# EAGLE design untitled (EAGLE 9.0.1)
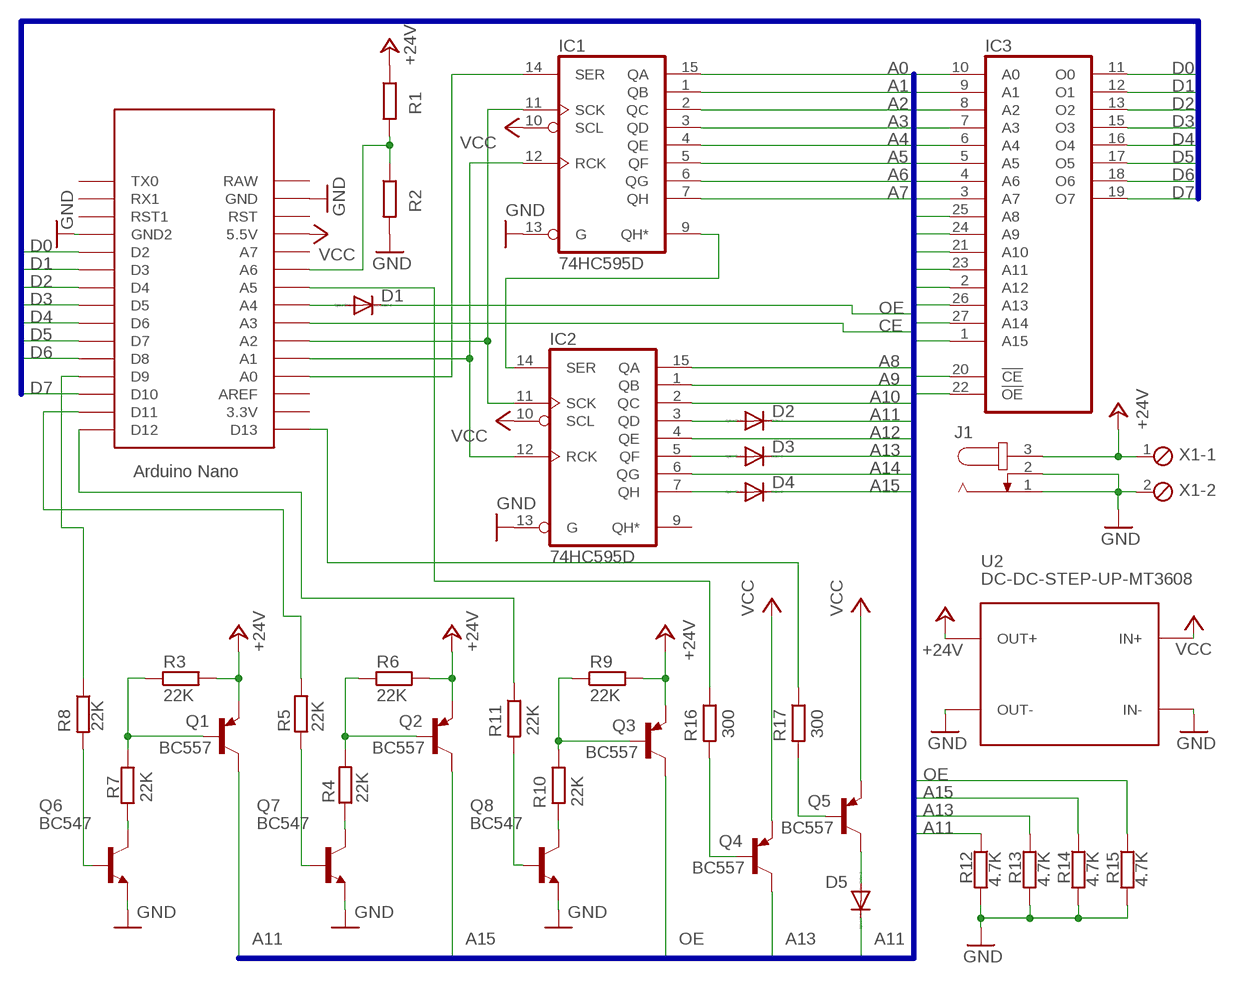
[diagram p0: schematic, sheet 1]

## Parts
D1  1N4446  [DO35-10]
D2  1N4446  [DO35-10]
D3  1N4446  [DO35-10]
D4  1N4446  [DO35-10]
D5  1N4446  [DO35-10]
IC1  74HC595D  [SO16]
IC2  74HC595D  [SO16]
IC3  27512  [DIL28]
J1  JACK-PLUG1  [SPC4078]
Q1  BC557  [TO92]
Q2  BC557  [TO92]
Q3  BC557  [TO92]
Q4  BC557  [TO92]
Q5  BC557  [TO92]
Q6  BC547  [TO92]
Q7  BC547  [TO92]
Q8  BC547  [TO92]
R1  R-EU_M0805  [M0805]
R2  R-EU_M0805  [M0805]
R3  22K  R-EU_M0805  [M0805]
R4  22K  R-EU_M0805  [M0805]
R5  22K  R-EU_M0805  [M0805]
R6  22K  R-EU_M0805  [M0805]
R7  22K  R-EU_M0805  [M0805]
R8  22K  R-EU_M0805  [M0805]
R9  22K  R-EU_M0805  [M0805]
R10  22K  R-EU_M0805  [M0805]
R11  22K  R-EU_M0805  [M0805]
R12  4.7K  R-EU_M0805  [M0805]
R13  4.7K  R-EU_M0805  [M0805]
R14  4.7K  R-EU_M0805  [M0805]
R15  4.7K  R-EU_M0805  [M0805]
R16  300  R-EU_M0805  [M0805]
R17  300  R-EU_M0805  [M0805]
U1  NANO  [NANO]
U2  DC-DC-STEP-UP-MT3608  [DC-DC-STEP-UP-MT3608]
X1  MPT2  [2POL254]

## Nets
+24V: J1.3 Q1.1(E) Q2.1(E) Q3.1(E) R1.1 R3.2 R6.2 R9.2 U2.OUT+ X1.1
A0: IC1.15(QA) IC3.10(A0)
A1: IC1.1(QB) IC3.9(A1)
A2: IC1.2(QC) IC3.8(A2)
A3: IC1.3(QD) IC3.7(A3)
A4: IC1.4(QE) IC3.6(A4)
A5: IC1.5(QF) IC3.5(A5)
A6: IC1.6(QG) IC3.4(A6)
A7: IC1.7(QH) IC3.3(A7)
A8: IC2.15(QA) IC3.25(A8)
A9: IC2.1(QB) IC3.24(A9)
A10: IC2.2(QC) IC3.21(A10)
A11: D2.C D5.C IC3.23(A11) Q1.3(C) R12.1
A12: IC2.4(QE) IC3.2(A12)
A13: D3.C IC3.26(A13) Q4.3(C) R13.1
A14: IC2.6(QG) IC3.27(A14)
A15: D4.C IC3.1(A15) Q2.3(C) R14.1
CE: IC3.20(!CE) U1.A3
D0: IC3.11(O0) U1.D2
D1: IC3.12(O1) U1.D3
D2: IC3.13(O2) U1.D4
D3: IC3.15(O3) U1.D5
D4: IC3.16(O4) U1.D6
D5: IC3.17(O5) U1.D7
D6: IC3.18(O6) U1.D8
D7: IC3.19(O7) U1.D10
GND: IC1.13(G) IC2.13(G) J1.1 J1.2 Q6.1(E) Q7.1(E) Q8.1(E) R2.2 R12.2 R13.2 R14.2 R15.2 U1.GND U1.GND1(GND2) U2.IN- U2.OUT- X1.2
N$1: IC1.11(SCK) IC2.11(SCK) U1.A2
N$2: IC1.12(RCK) IC2.12(RCK) U1.A1
N$3: IC1.9(QH*) IC2.14(SER)
N$4: IC1.14(SER) U1.A0
N$5: D2.A IC2.3(QD)
N$6: D3.A IC2.5(QF)
N$7: R8.1 U1.D9
N$8: D1.A U1.A4
N$9: R1.2 R2.1 U1.A6
N$10: R16.1 U1.A5
N$11: R5.2 U1.D11
N$12: R17.1 U1.D13
N$13: R11.1 U1.D12
N$14: D4.A IC2.7(QH)
N$15: D5.A Q5.3(C)
N$16: Q8.3(C) R10.2
N$17: Q3.2(B) R9.1 R10.1
N$18: Q8.2(B) R11.2
N$19: Q7.3(C) R4.1
N$20: Q2.2(B) R4.2 R6.1
N$21: Q7.2(B) R5.1
N$22: Q6.3(C) R7.2
N$23: Q1.2(B) R3.1 R7.1
N$24: Q6.2(B) R8.2
N$25: Q4.2(B) R16.2
N$26: Q5.2(B) R17.2
OE: D1.C IC3.22(!OE) Q3.3(C) R15.1
VCC: IC1.10(SCL) IC2.10(SCL) Q4.1(E) Q5.1(E) U1.5V(5.5V) U2.IN+
Unconnected: IC2.9(QH*) U1.3.3V U1.A7 U1.AREF U1.ICSP1 U1.ICSP2 U1.ICSP3 U1.ICSP4 U1.ICSP5 U1.ICSP6 U1.RAW U1.RST U1.RST1 U1.RX1 U1.TX0

## Buses
A0,A1,A2,A3,A4,A5,A6,A7,A8,A9,A10,A11,A12,A13,A14,A15,CE,OE
D0,D1,D2,D3,D4,D5,D6,D7

## Power pins joined to a net without a drawn wire
GND: IC1.8(GND) IC2.8(GND) IC3.14(GND)
VCC: IC1.16(VCC) IC2.16(VCC) IC3.28(VCC)

## Library data of the parts
D1-D5 = diode:1N4446: DIODE high speed (Philips)
IC1 IC2 = 74xx-eu:74*595: 8-bit SHIFT REGISTER, output latch
IC3 = memory:27512: MEMORY
J1 = con-jack:JACK-PLUG: DC POWER JACK Power Jack, DC, Right Angle, Through Hole, Rated 5A at 16VDC, PC Terminals Distributor: Farnell (www.Farnell.de) Drawing: 84N1161.pdf / 84N1162.pdf Manufacturer: SPC Technology (www.spctechnology.com) Type: SPC4077 / SPC 4078; OC_FARNELL: unknown; OC_NEWARK: unknown
Q1-Q5 = transistor-pnp:BC557: PNP Transistor
Q6-Q8 = transistor-npn:BC547*: NPN Transistor
R1-R17 = rcl:R-EU_: RESISTOR, European symbol; SPICEPREFIX: R
U1 = Arduino-clone:NANO: Arduino Nano
U2 = diy-modules:DC-DC-STEP-UP-MT3608: DC/DC Step-Up Regulator based on MT3608 chip MT3608 datasheet available here: https://www.olimex.com/Products/Breadboarding/BB-PWR-3608/resources/MT3608.pdf Click here to find device on ebay.com <http://www.ebay.com/sch/mt3608+module>
X1 = con-phoenix-254:MPT2: PHOENIX CONNECTOR; OC_FARNELL: unknown; OC_NEWARK: unknown

## Board
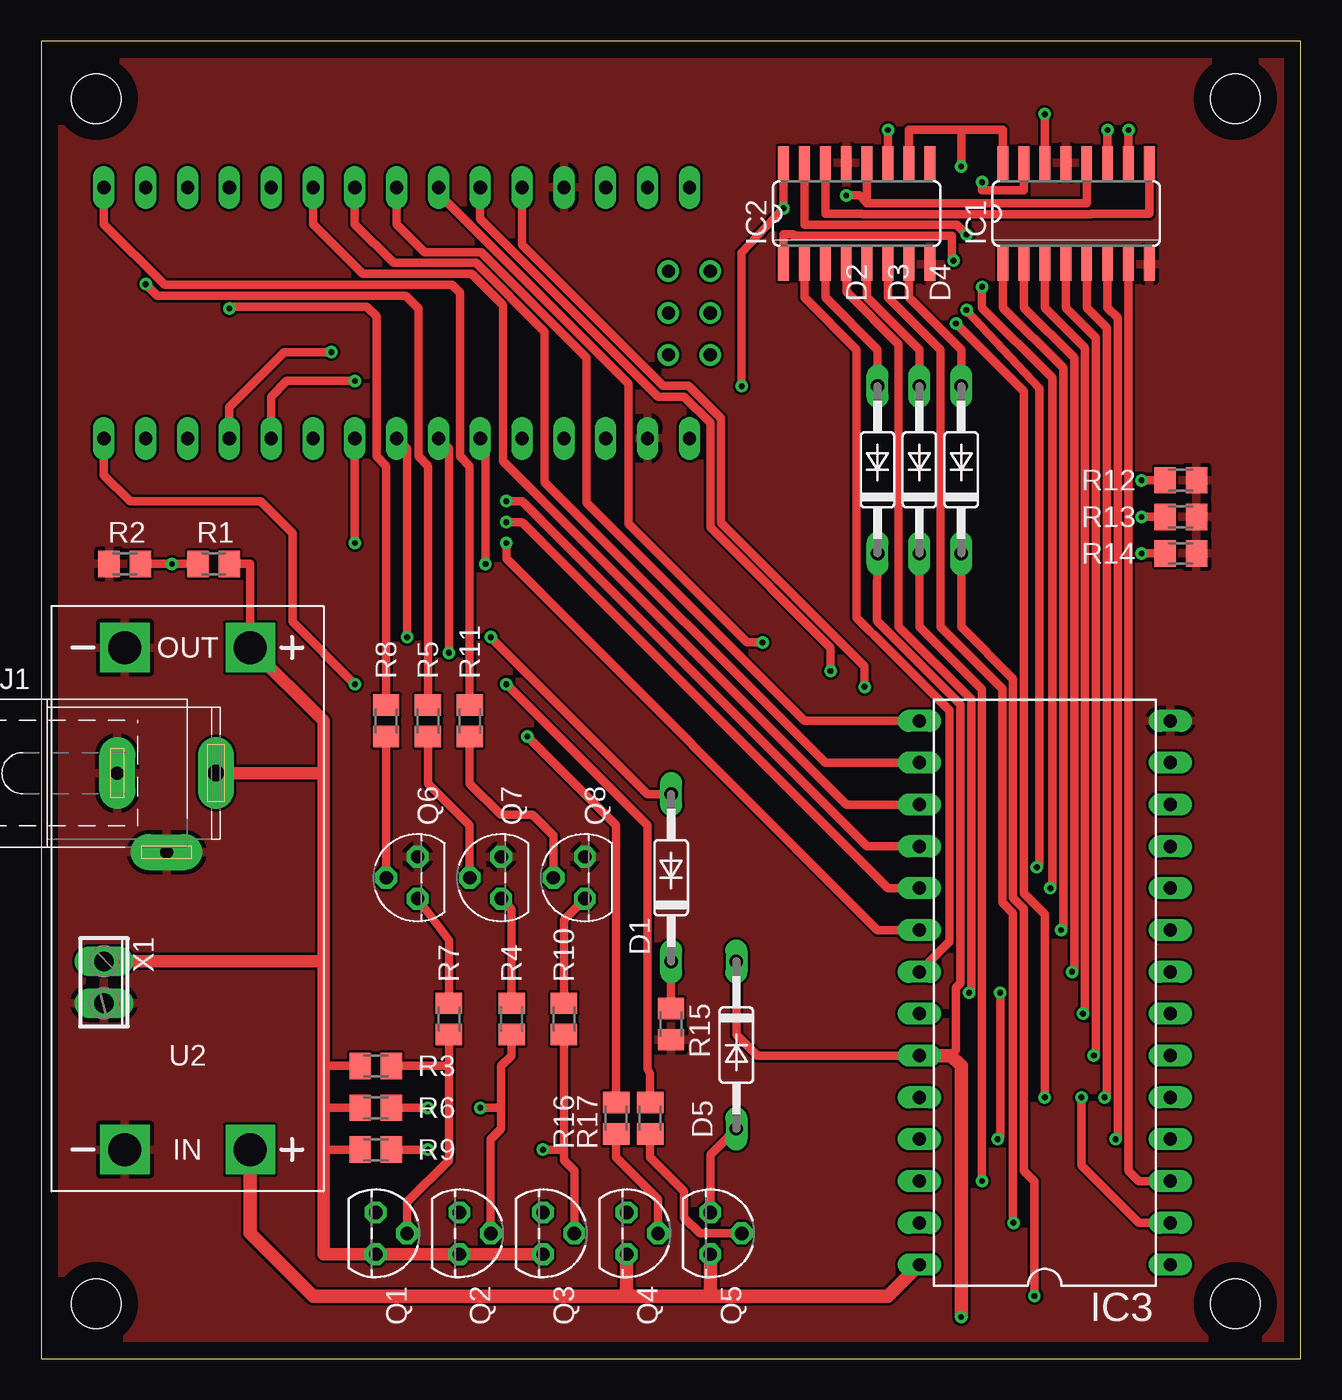
[diagram p1: board, top side]
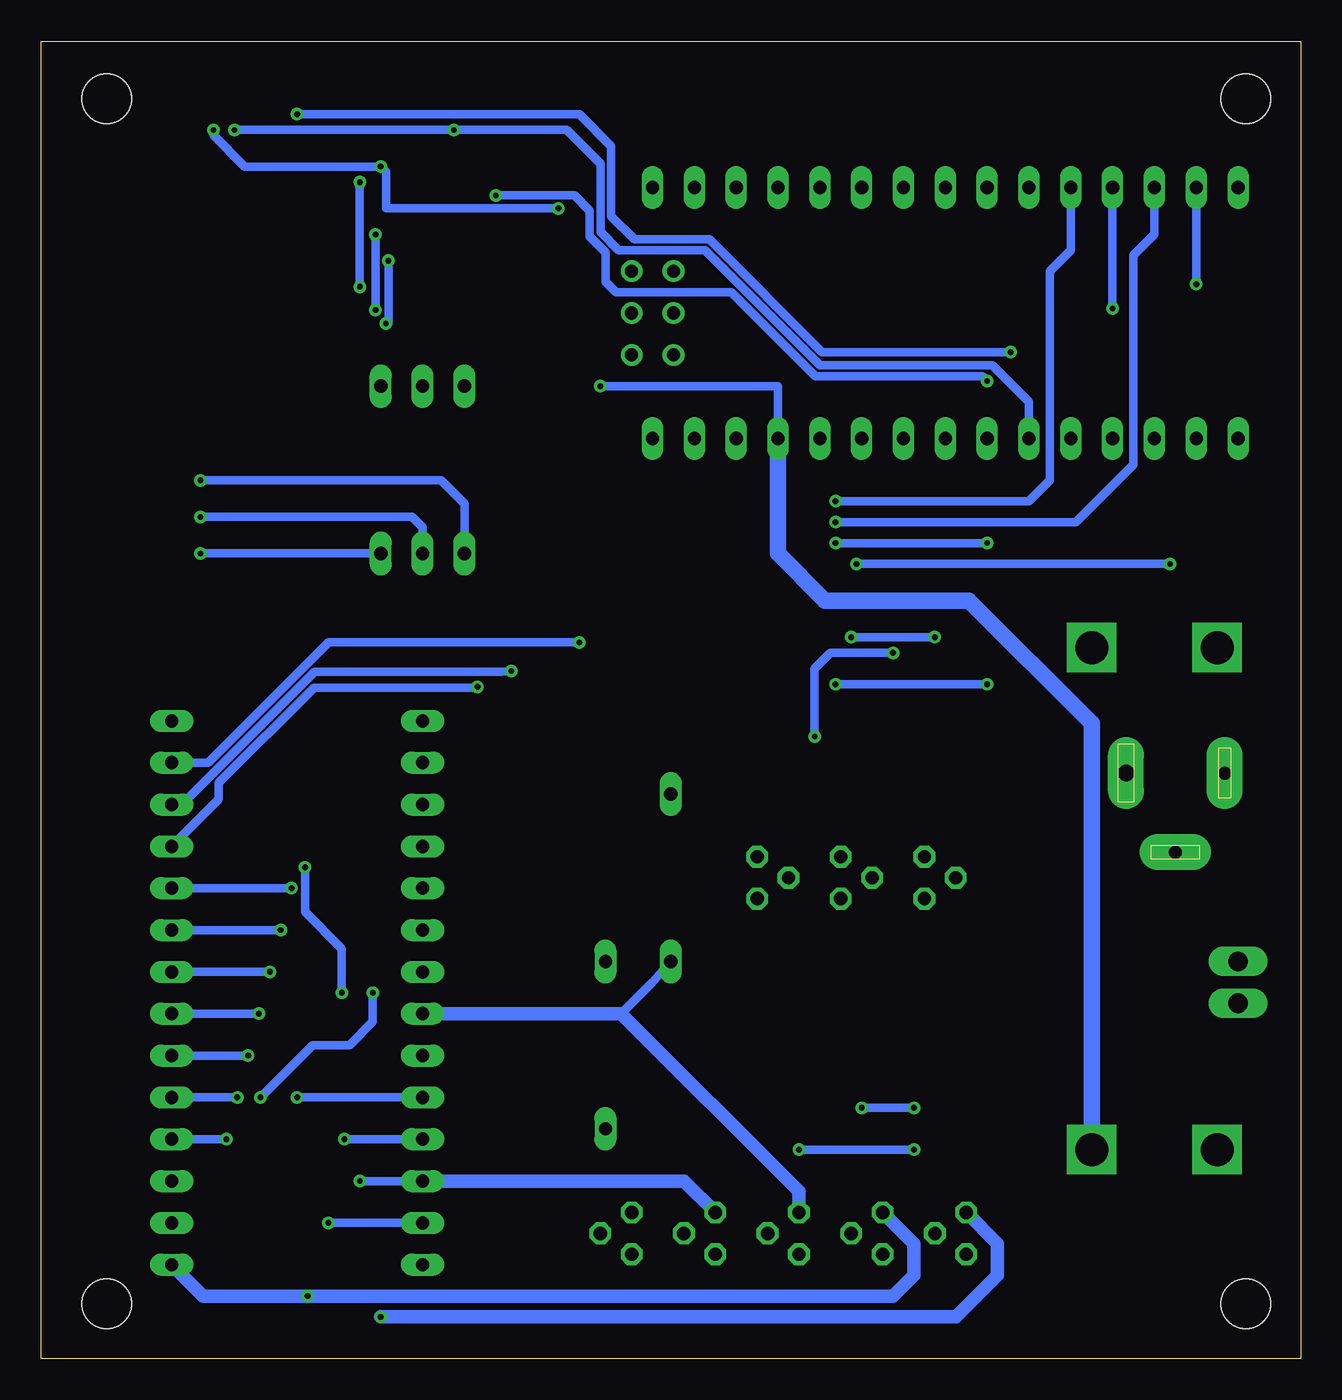
[diagram p2: board, bottom side, seen from below]

Size 76.5 x 80 mm. Coordinates in mm from the lower left corner, seen from the top.
Outline: 0,0 76.5,0 76.5,80 0,80 0,0
Copper layers (1*16): Top 0.035mm / dielectric 1.5mm / Bottom 0.035mm
Design rules "default": minimum track width 6mil, minimum drill 0.35mm, track to track 6mil, track to pad 6mil, pad to pad 6mil, via to via 6mil, smd to smd 6mil, copper to edge 40mil, drill to drill 6mil, minimum pad ring 10mil, minimum via ring 8mil, stop-mask expansion 4mil, vias tented up to drill 0mil, thermal gap 10mil
Holes 3 mm at 3.33,76.52 3.33,3.33 72.52,76.52 72.52,3.33

### Footprints (pad centres in the part's own frame; a part is rotated, then mirrored left to right if it is on the bottom)
DO35-10 = drill 0.813 long: A 5.08,0; C -5.08,0
SO16 = smd 0.66 x 2.032: 1 -4.445,-3.073; 2 -3.175,-3.073; 3 -1.905,-3.073; 4 -0.635,-3.073; 5 0.635,-3.073; 6 1.905,-3.073; 7 3.175,-3.073; 8 4.445,-3.073; 9 4.445,3.073; 10 3.175,3.073; 11 1.905,3.073; 12 0.635,3.073; 13 -0.635,3.073; 14 -1.905,3.073; 15 -3.175,3.073; 16 -4.445,3.073
DIL28 = drill 0.813 long: 1 -16.51,-7.62; 2 -13.97,-7.62; 3 -11.43,-7.62; 4 -8.89,-7.62; 5 -6.35,-7.62; 6 -3.81,-7.62; 7 -1.27,-7.62; 8 1.27,-7.62; 9 3.81,-7.62; 10 6.35,-7.62; 11 8.89,-7.62; 12 11.43,-7.62; 13 13.97,-7.62; 14 16.51,-7.62; 15 16.51,7.62; 16 13.97,7.62; 17 11.43,7.62; 18 8.89,7.62; 19 6.35,7.62; 20 3.81,7.62; 21 1.27,7.62; 22 -1.27,7.62; 23 -3.81,7.62; 24 -6.35,7.62; 25 -8.89,7.62; 26 -11.43,7.62; 27 -13.97,7.62; 28 -16.51,7.62
SPC4078 = drill 0.8 pad 2.184 long: 1 -3,0; 2 0,-4.8 | drill 1 pad 2.184 long: 3 3,0
TO92 = drill 0.813 octagon: 1 1.27,0; 2 0,1.905; 3 -1.27,0
M0805 = smd 1.3 x 1.6: 1 -0.95,0; 2 0.95,0
NANO = drill 0.8 long: 3.3V -10.16,24.13; 5V -10.16,-1.27; A0 -10.16,19.05; A1 -10.16,16.51; A2 -10.16,13.97; A3 -10.16,11.43; A4 -10.16,8.89; A5 -10.16,6.35; A6 -10.16,3.81; A7 -10.16,1.27; AREF -10.16,21.59; D2 5.08,1.27; D3 5.08,3.81; D4 5.08,6.35; D5 5.08,8.89; D6 5.08,11.43; D7 5.08,13.97; D8 5.08,16.51; D9 5.08,19.05; D10 5.08,21.59; D11 5.08,24.13; D12 5.08,26.67; D13 -10.16,26.67; GND -10.16,-6.35; GND1 5.08,-1.27; RAW -10.16,-8.89; RST -10.16,-3.81; RST1 5.08,-3.81; RX1 5.08,-6.35; TX0 5.08,-8.89 | drill 0.8: ICSP1 -5.08,-10.16; ICSP2 -5.08,-7.62; ICSP3 -2.54,-10.16; ICSP4 -2.54,-7.62; ICSP5 0,-10.16; ICSP6 0,-7.62
DC-DC-STEP-UP-MT3608 = drill 2 pad 2.8 square: IN+ 15.24,3.81; IN- 15.24,-3.81; OUT+ -15.24,3.81; OUT- -15.24,-3.81
2POL254 = drill 1.2 long: 1 -1.27,0; 2 1.27,0

### Placement (x,y rotation side)
D1  38.26,29.21 90 top
D2  50.8,53.98 90 top
D3  53.34,53.98 90 top
D4  55.88,53.98 90 top
D5  42.23,19.05 270 top
IC1  62.87,69.53 0 top
IC2  49.53,69.53 0 top
IC3  60.96,22.23 90 top
J1  7.62,35.56 0 top
Q1  20.32,7.62 270 top
Q2  25.4,7.62 270 top
Q3  30.48,7.62 270 top
Q4  35.56,7.62 270 top
Q5  40.64,7.62 270 top
Q6  22.86,29.21 90 top
Q7  27.94,29.21 90 top
Q8  33.02,29.21 90 top
R1  10.48,48.26 180 top
R2  5.08,48.26 180 top
R3  20.32,17.78 180 top
R4  28.57,20.64 270 top
R5  23.5,38.73 90 top
R6  20.32,15.24 180 top
R7  24.77,20.64 90 top
R8  20.95,38.73 270 top
R9  20.32,12.7 180 top
R10  31.75,20.64 90 top
R11  26.04,38.73 270 top
R12  69.22,53.34 0 top
R13  69.22,51.12 0 top
R14  69.22,48.9 0 top
R15  38.26,20.32 270 top
R16  34.92,14.61 270 top
R17  36.99,14.61 270 top
U1  30.48,66.04 90 top
U2  8.89,27.94 270 top
X1  3.81,22.86 270 top

### Tracks (layer width: path | path; a pad name or v marks a point on that pad's centre or on a via)
+24V
  Top 0.508: R3.2 17.14,17.78 | R6.2 17.14,15.24 | R9.2 17.14,12.7 | U2.OUT+ 12.7,48.26 R1.1
  Top 0.762: Q3.1 Q2.1 Q1.1 17.14,6.35 17.14,12.7 17.14,15.24 17.14,17.78 17.14,24.13 | 17.14,24.13 17.14,35.56 | 17.14,35.56 17.14,38.73 U2.OUT+ | X1.1 17.14,24.13 | J1.3 17.14,35.56
A0  (via drill 0.35)
  Top 0.508: IC1.15 59.69,70.96 57.15,70.96 v57.15,71.44 | v61.29,28.57 61.42,28.7 61.42,59.55 57.15,63.82 v57.15,65.09
  Bottom 0.508: v61.29,28.57 IC3.10 | v57.15,71.44 v57.15,65.09
A1  (via drill 0.35)
  Top 0.508: v61.95,26.04 62.08,26.16 62.08,60.16 58.42,63.82 IC1.1
  Bottom 0.508: v61.95,26.04 IC3.9
A2  (via drill 0.35)
  Top 0.508: IC1.2 59.69,63.82 62.74,60.77 62.74,23.62 v62.61,23.5
  Bottom 0.508: v62.61,23.5 IC3.8
A3  (via drill 0.35)
  Top 0.508: IC1.3 60.96,63.82 63.4,61.38 63.4,21.08 v63.27,20.95
  Bottom 0.508: v63.27,20.95 IC3.7
A4  (via drill 0.35)
  Top 0.508: v63.94,18.41 64.06,18.54 64.06,61.99 62.23,63.82 IC1.4
  Bottom 0.508: v63.94,18.41 IC3.6
A5  (via drill 0.35)
  Top 0.508: IC1.5 63.5,63.82 64.72,62.6 64.72,16 v64.59,15.88
  Bottom 0.508: v64.59,15.88 IC3.5
A6  (via drill 0.35)
  Top 0.508: IC1.6 64.77,63.82 65.38,63.21 65.38,13.46 v65.25,13.34
  Bottom 0.508: v65.25,13.34 IC3.4
A7
  Top 0.508: IC1.7 66.04,11.43 66.67,10.79 IC3.3
A8  (via drill 0.35)
  Top 0.508: v56.2,63.68 60.63,58.92 60.63,30 v60.48,29.84 | v56.2,68.26 55.61,68.85 46.35,68.85 IC2.15 | v58.24,22.23 58.24,13.49 v58.09,13.34
  Bottom 0.508: v56.2,68.26 v56.2,63.68 | v58.09,13.34 IC3.25 | v60.48,29.84 60.48,27.14 58.24,24.91 v58.24,22.23
A9  (via drill 0.35)
  Top 0.508: v60.96,15.88 60.96,26.99 59.69,28.26 59.69,58.74 v55.56,62.87 | IC2.1 45.09,68.26 45.7,68.26 45.7,68.19 55.31,68.19 55.31,66.78 v55.41,66.67
  Bottom 0.508: IC3.24 v60.96,15.88 | v55.41,66.67 55.41,62.87 v55.56,62.87
A10
  Top 0.508: IC2.2 46.35,64.45 49.53,61.28 49.53,44.98 50.36,44.15 50.55,43.99 55.17,39.37 55.17,25.32 IC3.21
A11  (via drill 0.35)
  Top 0.508: D2.C 50.77,45.74 50.77,44.81 55.83,39.76 55.83,22.81 55.56,22.54 55.56,18.73 55.24,18.41 | R12.1 v66.83,53.34 | D5.C 42.23,19.68 43.5,18.41 IC3.23
  Top 0.813: v55.88,2.54 55.88,17.78 55.24,18.41 IC3.23
  Bottom 0.508: v66.83,53.34 52.23,53.34 50.8,51.91 D2.C
  Bottom 0.813: Q1.3 18.41,6.99 18.41,5.08 20.95,2.54 v55.88,2.54
A12  (via drill 0.35)
  Top 0.508: IC2.4 48.9,64.79 52.07,61.61 52.07,44.45 56.49,40.03 56.49,22.35 v56.37,22.23 | v63.18,15.88 63.18,11.75 66.67,8.26 IC3.2
  Bottom 0.508: v56.37,22.23 56.37,20.47 57.78,19.05 60.01,19.05 v63.18,15.88
A13  (via drill 0.35)
  Top 0.508: D3.C 53.34,44.45 57.15,40.64 v57.15,10.79 | R13.1 v66.83,51.12
  Bottom 0.508: v57.15,10.79 IC3.26 | v66.83,51.12 53.98,51.12 53.34,50.48 D3.C
  Bottom 0.813: Q4.3 37.47,10.79 IC3.26
A14  (via drill 0.35)
  Top 0.508: IC2.6 51.44,64.45 54.61,61.28 54.61,44.45 58.37,40.69 58.37,27.71 59.03,27.05 59.03,8.28 v59.05,8.26
  Bottom 0.508: v59.05,8.26 IC3.27
A15  (via drill 0.35)
  Top 0.508: v60.33,3.81 60.33,10.79 59.69,11.43 59.69,27.32 59.03,27.98 59.03,41.3 55.88,44.45 D4.C | R14.1 v66.83,48.9
  Bottom 0.508: v66.83,48.9 D4.C
  Bottom 0.813: Q2.3 23.5,6.99 23.5,5.08 24.77,3.81 v60.33,3.81 66.67,3.81 IC3.1
CE  (via drill 0.35)
  Top 0.508: IC3.20 50.8,26.04 28.26,48.58 v28.26,49.53 | v19.05,49.53 U1.A3
  Bottom 0.508: v28.26,49.53 v19.05,49.53
D0  (via drill 0.35)
  Top 0.508: v50.01,40.8 50,40.81 50,42.06 41.3,50.76 41.3,57.11 39.33,59.08 37.78,59.08 29.21,67.65 U1.D2
  Bottom 0.508: IC3.11 65.72,33.97 65.72,34.96 59.94,40.75 50.11,40.75 v50.01,40.8
D1  (via drill 0.35)
  Top 0.508: v47.94,41.76 47.94,43.18 40.64,50.48 40.64,56.83 39.05,58.42 37.47,58.42 26.67,69.22 U1.D3
  Bottom 0.508: IC3.12 67.96,33.66 59.89,41.73 48.54,41.73 v47.94,41.76
D2  (via drill 0.35)
  Top 0.508: U1.D4 24.13,70.73 35.67,59.2 35.67,50.69 42.86,43.5 v43.81,43.5
  Bottom 0.508: IC3.13 66.36,36.2 59.05,43.5 v43.81,43.5
D3
  Top 0.508: IC3.15 46.35,38.73 33.13,51.96 33.13,60.78 26.72,67.19 23.3,67.19 21.59,68.9 U1.D5
D4
  Top 0.508: IC3.16 47.62,36.2 30.59,53.23 30.59,62.37 26.43,66.53 21.41,66.53 19.05,68.9 U1.D6
D5
  Top 0.508: IC3.17 48.9,33.66 28.05,54.5 28.05,63.96 26.13,65.87 19.54,65.87 16.51,68.9 U1.D7
D6  (via drill 0.35)
  Top 0.508: IC3.18 50.16,31.11 29.21,52.07 v28.26,52.07
  Bottom 0.508: v28.26,52.07 16.51,52.07 15.24,53.34 15.24,66.04 13.97,67.31 U1.D8
D7  (via drill 0.35)
  Top 0.508: IC3.19 51.44,28.57 29.21,50.8 v28.26,50.8
  Bottom 0.508: v28.26,50.8 13.65,50.8 10.16,54.29 10.16,66.99 8.89,68.26 U1.D10
GND
  pour Top: 0,80.01 76.52,80.01 76.52,0 0,0
N$1  (via drill 0.35)
  Top 0.508: IC2.11 v51.44,74.61 | v64.77,74.61 IC1.11
  Bottom 0.508: v64.77,74.61 v51.44,74.61 44.61,74.61 42.55,72.55 42.55,68.42 41.43,67.31 36.2,67.31 29.21,60.33 18.73,60.33 16.51,58.1 U1.A2
N$2  (via drill 0.35)
  Top 0.508: IC2.12 50.16,70.17 | 50.16,70.17 63.5,70.17 IC1.12 | 50.16,70.17 49.7,70.64 v48.9,70.64 | U1.A1 13.97,58.42 14.92,59.37 v19.05,59.37
  Bottom 0.508: v19.05,59.37 19.34,59.66 29.48,59.66 34.59,64.77 41.59,64.77 42.23,65.41 42.23,67.17 43.2,68.15 43.2,69.72 44.12,70.64 v48.9,70.64
N$3
  Top 0.508: IC1.9 67.31,69.53 63.8,69.53 63.77,69.51 49.89,69.51 49.87,69.53 47.62,69.53 IC2.14
N$4  (via drill 0.35)
  Top 0.508: IC1.14 v60.96,75.56 | v17.62,61.12 14.76,61.12 11.43,57.78 U1.A0
  Bottom 0.508: v17.62,61.12 29.07,61.12 35.92,67.97 39.69,67.97 39.71,67.97 40.48,67.97 41.88,69.37 41.88,73.64 43.81,75.56 v60.96,75.56
N$5
  Top 0.508: IC2.3 47.62,64.45 50.8,61.28 D2.A
N$6
  Top 0.508: IC2.5 50.16,64.45 53.34,61.28 D3.A
N$7  (via drill 0.35)
  Top 0.508: R8.1 20.95,54.2 20.37,54.79 20.37,63.29 19.77,63.89 11.55,63.89 v11.43,63.77
  Bottom 0.508: v11.43,63.77 U1.D9
N$8  (via drill 0.35)
  Top 0.508: D1.A 36.83,34.29 v27.3,43.81 | v22.23,43.81 22.23,55.24 U1.A4
  Bottom 0.508: v27.3,43.81 v22.23,43.81
N$9  (via drill 0.35)
  Top 0.508: R1.2 v7.94,48.26 R2.1 | v26.99,48.26 26.99,55.56 U1.A6
  Bottom 0.508: v7.94,48.26 v26.99,48.26
N$10  (via drill 0.35)
  Top 0.508: R16.1 34.92,32.38 v29.53,37.78 | v24.77,42.86 24.77,55.24 U1.A5
  Bottom 0.508: v29.53,37.78 29.53,41.91 28.57,42.86 v24.77,42.86
N$11  (via drill 0.35)
  Top 0.508: R5.2 23.5,54.2 22.91,54.79 22.91,63.77 22.13,64.55 7.05,64.55 v6.35,65.25
  Bottom 0.508: v6.35,65.25 U1.D11
N$12  (via drill 0.35)
  Top 0.508: R17.1 36.99,17.3 36.83,17.62 36.83,32.38 v28.26,40.96 | v19.05,40.96 15.27,44.74 15.27,50.12 13.32,52.07 5.4,52.07 3.81,53.66 U1.D13
  Bottom 0.508: v28.26,40.96 v19.05,40.96
N$13
  Top 0.508: R11.1 26.04,54.2 25.45,54.79 25.45,64.72 24.96,65.21 7.5,65.21 3.81,68.9 U1.D12
N$14
  Top 0.508: IC2.7 52.7,64.45 55.88,61.28 D4.A
N$15
  Top 0.508: Q5.3 40.64,12.38 D5.A
N$16
  Top 0.508: Q8.3 31.75,26.67 R10.2
N$17  (via drill 0.35)
  Top 0.508: R10.1 31.75,12.7 | 31.75,12.7 31.75,12.06 32.38,11.43 Q3.2 | R9.1 v23.5,12.7 | v30.48,12.7 31.75,12.7
  Bottom 0.508: v23.5,12.7 v30.48,12.7
N$18
  Top 0.508: R11.2 26.04,34.92 27.94,33.02 29.84,33.02 31.11,31.75 Q8.2
N$19
  Top 0.508: Q7.3 28.57,27.3 R4.1
N$20  (via drill 0.35)
  Top 0.508: R4.2 28.57,18.41 27.94,17.78 27.94,15.24 | Q2.2 27.3,13.34 27.94,13.97 27.94,15.24 | R6.1 v23.5,15.24 | v26.67,15.24 27.94,15.24
  Bottom 0.508: v23.5,15.24 v26.67,15.24
N$21
  Top 0.508: R5.1 23.5,34.92 26.04,32.38 Q7.2
N$22
  Top 0.508: Q6.3 24.77,25.4 R7.2
N$23
  Top 0.508: R7.1 24.77,17.78 | 24.77,17.78 24.77,12.06 22.23,9.53 Q1.2 | R3.1 24.77,17.78
N$24
  Top 0.508: R8.2 Q6.2
N$25
  Top 0.508: R16.2 34.92,12.22 37.47,9.68 Q4.2
N$26
  Top 0.508: R17.2 36.99,12.22 39.05,10.16 39.05,8.57 40.01,7.62 Q5.2
OE
  Top 0.508: R15.1 D1.C
  Bottom 0.508: D1.C 39.37,22.86 41.27,20.95
  Bottom 0.813: Q3.3 30.48,10.16 41.27,20.95 IC3.22
VCC  (via drill 0.35)
  Top 0.508: 55.88,74.61 58.42,74.61 IC1.16 | 55.88,74.61 52.7,74.61 IC2.10 | IC2.16 v45.09,69.85 42.55,67.15 v42.55,59.05 | v55.88,72.39 55.88,74.61 | v66.04,74.61 IC1.10
  Top 0.813: U2.IN+ 12.7,7.62 16.51,3.81 35.56,3.81 | IC3.28 51.44,3.81 40.64,3.81 | 35.56,3.81 40.64,3.81 | Q4.1 35.56,3.81 | Q5.1 40.64,3.81
  Bottom 0.508: v45.09,69.85 55.56,69.85 55.56,72.07 v55.88,72.39 64.14,72.39 66.04,74.3 v66.04,74.61 | v42.55,59.05 31.75,59.05 U1.5V
  Bottom 1.016: U1.5V 31.75,48.9 28.89,46.04 20.16,46.04 12.7,38.58 U2.IN+